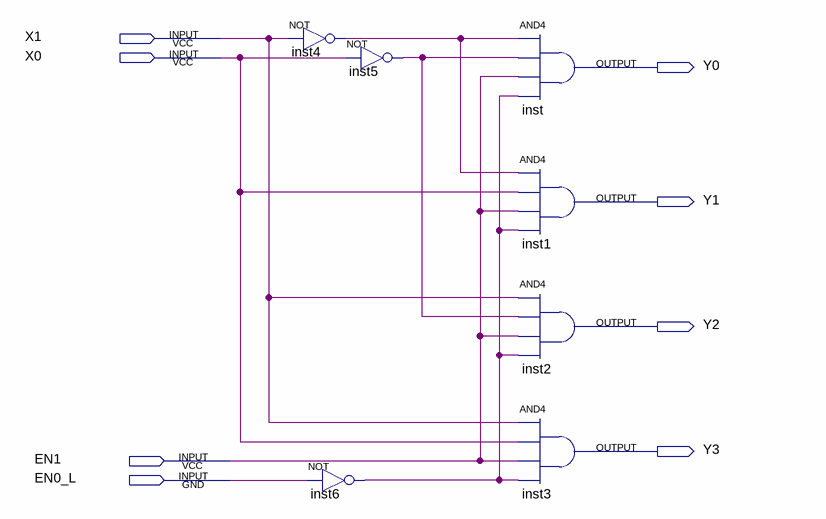
[diagram p0: schematic sheet]
// Quartus schematic Dec2_4.bdf as structural Verilog: 7 symbols, 8 pins
module Dec2_4 (
  input  X1,
  input  X0,
  input  EN1,
  input  EN0_L,
  output Y0,
  output Y1,
  output Y2,
  output Y3
);

  wire inst4_out, inst5_out, inst6_out;

  not inst4 (inst4_out, X1);
  not inst6 (inst6_out, EN0_L);
  not inst5 (inst5_out, X0);
  and inst (Y0, inst4_out, inst5_out, EN1, inst6_out);
  and inst1 (Y1, inst4_out, X0, EN1, inst6_out);
  and inst2 (Y2, X1, inst5_out, EN1, inst6_out);
  and inst3 (Y3, X1, X0, EN1, inst6_out);
endmodule
